# EAGLE schematic regulator (EAGLE 9.6.2)
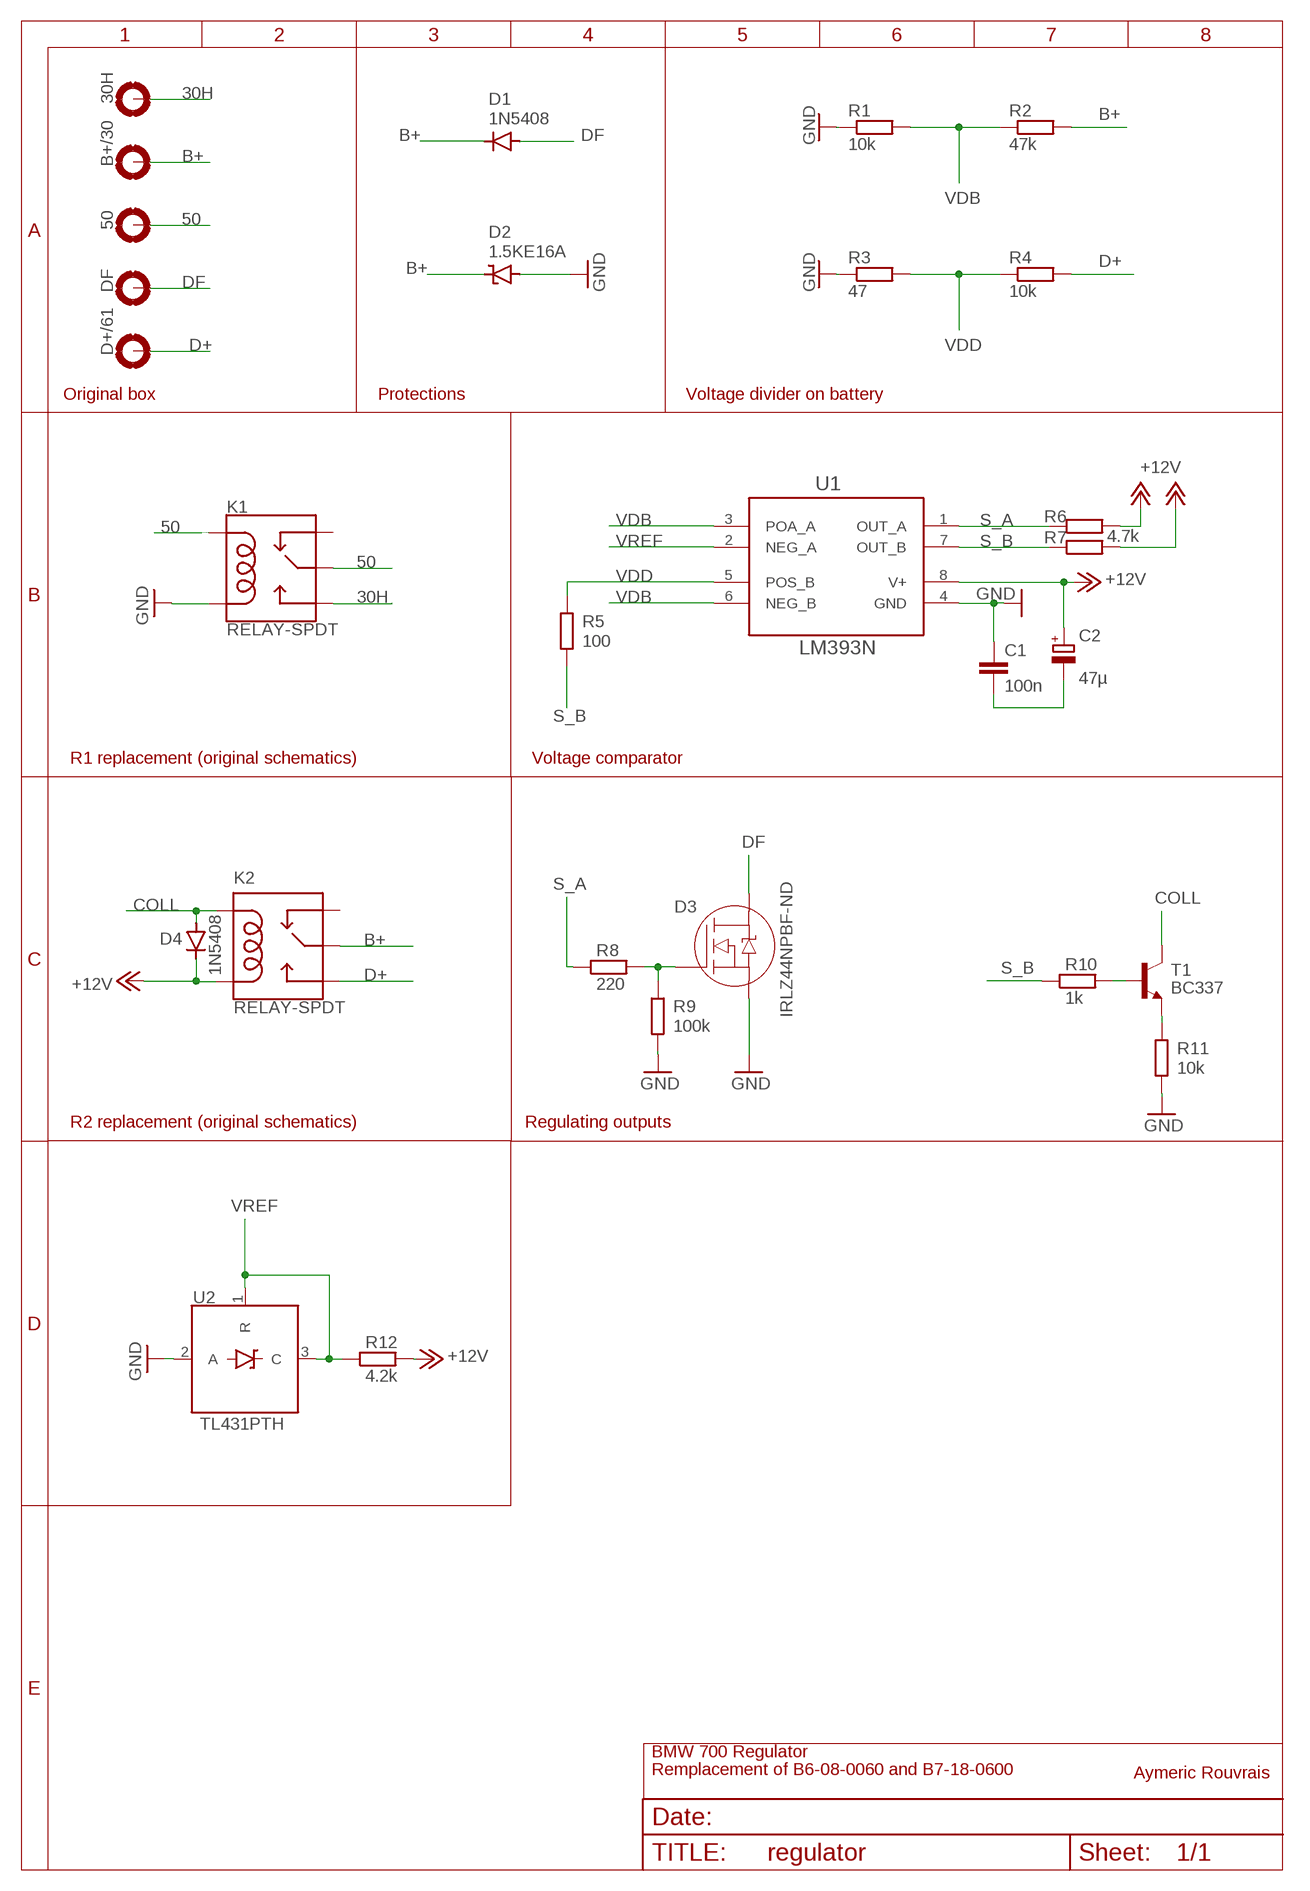
[diagram p0: schematic, sheet 1]

## Parts
30H  MOUNT-PAD-ROUND3.0  [3,0-PAD]
50  MOUNT-PAD-ROUND3.0  [3,0-PAD]
B+/30  MOUNT-PAD-ROUND3.0  [3,0-PAD]
C1  100n  C-EU050-025X075  [C050-025X075]
C2  47µ  CPOL-EUE2.5-7  [E2,5-7]
D1  1N5408  [1N5408]
D2  1.5KE16A  [1.5KE16A]
D3  IRLZ44NPBF-ND  [TO220AB]
D4  1N5408  [1N5408]
D+/61  MOUNT-PAD-ROUND3.0  [3,0-PAD]
DF  MOUNT-PAD-ROUND3.0  [3,0-PAD]
K1  RELAY-SPDT  [RELAY_G5LE]
K2  RELAY-SPDT  [RELAY_G5LE]
R1  10k  R-EU_0204/7  [0204/7]
R2  47k  R-EU_0204/7  [0204/7]
R3  47  R-EU_0204/7  [0204/7]
R4  10k  R-EU_0204/7  [0204/7]
R5  100  R-EU_0204/7  [0204/7]
R6  4.7k  R-EU_0204/7  [0204/7]
R7  4.7k  R-EU_0204/7  [0204/7]
R8  220  R-EU_0204/7  [0204/7]
R9  100k  R-EU_0204/7  [0204/7]
R10  1k  R-EU_0204/7  [0204/7]
R11  10k  R-EU_0204/7  [0204/7]
R12  4.2k  R-EU_0204/7  [0204/7]
T1  BC337  [TO92]
U1  LM393N  [DIP254P762X508-8]
U2  TL431PTH  [TO-92]

## Nets
30H: 30H.B3,0(MOUNT) K1.3(NO)
50: 50.B3,0(MOUNT) K1.1(MAIN) K1.2(COIL1)
+12V: C2.+ D4.1(C) K2.5(COIL2) R6.2 R7.2 R12.2 U1.8(V+)
B+: B+/30.B3,0(MOUNT) D1.1(C) D2.1(C) K2.1(MAIN) R2.2
COLL: D4.2(A) K2.2(COIL1) T1.3(C)
D+: D+/61.B3,0(MOUNT) K2.3(NO) R4.2
DF: D1.2(A) D3.1(D) DF.B3,0(MOUNT)
GND: C1.1 D2.2(A) D3.3(S) K1.5(COIL2) R1.1 R3.1 R9.2 R11.1 U1.4(GND) U2.2(A)
N$1: D3.2(G) R8.2 R9.1
N$2: R10.2 T1.2(B)
N$3: R11.2 T1.1(E)
N$9: C1.2 C2.-
S_A: R6.1 R8.1 U1.1(OUT_A)
S_B: R5.1 R7.1 R10.1 U1.7(OUT_B)
VDB: R1.2 R2.1 U1.3(POA_A) U1.6(NEG_B)
VDD: R3.2 R4.1 R5.2 U1.5(POS_B)
VREF: R12.1 U1.2(NEG_A) U2.1(R) U2.3(C)
Unconnected: K1.4(NC) K2.4(NC)

## Notes on the sheet
- Original box | Protections | Voltage divider on battery
- R1 replacement (original schematics) | Voltage comparator
- R2 replacement (original schematics) | Regulating outputs
- BMW 700 Regulator
- Remplacement of B6-08-0060 and B7-18-0600 | Aymeric Rouvrais

## Library data of the parts
30H 50 B+/30 D+/61 DF = holes:MOUNT-PAD-ROUND: MOUNTING PAD, round
C1 = rcl:C-EU: CAPACITOR, European symbol; SPICEPREFIX: C
C2 = rcl:CPOL-EU: POLARIZED CAPACITOR, European symbol; SPICEPREFIX: C
D1 D4 = 1N5408:1N5408: Check availability <https://pricing.snapeda.com/parts/1.5KE75A/Littelfuse/view-part?ref=eda>; AVAILABILITY: In Stock; CHECK_PRICES: https://www.snapeda.com/parts/1.5KE75A/Littelfuse/view-part/?ref=eda; DESCRIPTION: 1500W Axial Leaded Transient Voltage Suppression (TVS) Diode | Littelfuse 1.5KE75A; MF: Littelfuse; MP: 1.5KE75A; PACKAGE: DO-201 Littelfuse; PRICE: None; SNAPEDA_LINK: https://www.snapeda.com/parts/1.5KE75A/Littelfuse/view-part/?ref=snap
D2 = 1.5KE16A:1.5KE16A: Check availability <https://pricing.snapeda.com/parts/1.5KE75A/Littelfuse/view-part?ref=eda>; AVAILABILITY: In Stock; CHECK_PRICES: https://www.snapeda.com/parts/1.5KE75A/Littelfuse/view-part/?ref=eda; DESCRIPTION: 1500W Axial Leaded Transient Voltage Suppression (TVS) Diode | Littelfuse 1.5KE75A; MF: Littelfuse; MP: 1.5KE16A; PACKAGE: DO-201; PRICE: None; SNAPEDA_LINK: https://www.snapeda.com/parts/1.5KE75A/Littelfuse/view-part/?ref=snap
D3 = IRLZ44NPBF-ND:IRLZ44NPBF-ND: Check availability <https://pricing.snapeda.com/parts/SR1660/Taiwan%20Semiconductor/view-part?ref=eda>; AVAILABILITY: In Stock; CHECK_PRICES: https://www.snapeda.com/parts/SR1660/taiwan/view-part/?ref=eda; DESCRIPTION: 16A, 60V, Automotive Planar Schottky; MF: Taiwan Semiconductor; MP: SR1660; PACKAGE: TO-220AB-3 Taiwan Semiconductor; PRICE: None; SNAPEDA_LINK: https://www.snapeda.com/parts/SR1660/taiwan/view-part/?ref=snap
K1 K2 = SparkFun-Electromechanical:RELAY-SPDT: SPDT Electromechanical Relay Single-pole, double-throw sealed relays. When current is applied to the coil, it throws a simple changeover switch, terminating the connection from the NC contact to ground and closing the NO contact. Use them to switch high voltage/high current devices. SparkFun Products JQX-15F: Relay SPDT Sealed - 20A <https://www.sparkfun.com/products/10924> (COM-10924) JZC-11F: Relay SPDT Sealed <https://www.sparkfun.com/products/100> (COM-00100); PROD_ID: COMP-14214
R1-R12 = rcl:R-EU_: RESISTOR, European symbol; SPICEPREFIX: R
T1 = transistor:BC337: NPN TRANSISTOR
U1 = LM393N:LM393N: Check availability <https://pricing.snapeda.com/parts/LM393N/STMicroelectronics/view-part?ref=eda>; AVAILABILITY: In Stock; CHECK_PRICES: https://www.snapeda.com/parts/LM393N/STMicroelectronics/view-part/?ref=eda; DESCRIPTION: Comparator General Purpose CMOS, DTL, ECL, MOS, Open-Collector, TTL 8-DIP; MF: STMicroelectronics; MP: LM393N; PACKAGE: DIP-8 STMicroelectronics; PRICE: None; SNAPEDA_LINK: https://www.snapeda.com/parts/LM393N/STMicroelectronics/view-part/?ref=snap
U2 = TL431:TL431: Check availability <https://pricing.snapeda.com/parts/TL431/onsemi/view-part?ref=eda>; AVAILABILITY: In Stock; CHECK_PRICES: https://www.snapeda.com/parts/TL431/Onsemi/view-part/?ref=eda; DESCRIPTION: IC VREF SHUNT ADJ 0.4% TO92-3; MF: onsemi; MP: TL431; PACKAGE: None; PRICE: None; SNAPEDA_LINK: https://www.snapeda.com/parts/TL431/Onsemi/view-part/?ref=snap